# EAGLE design Schematics (EAGLE 6.0)
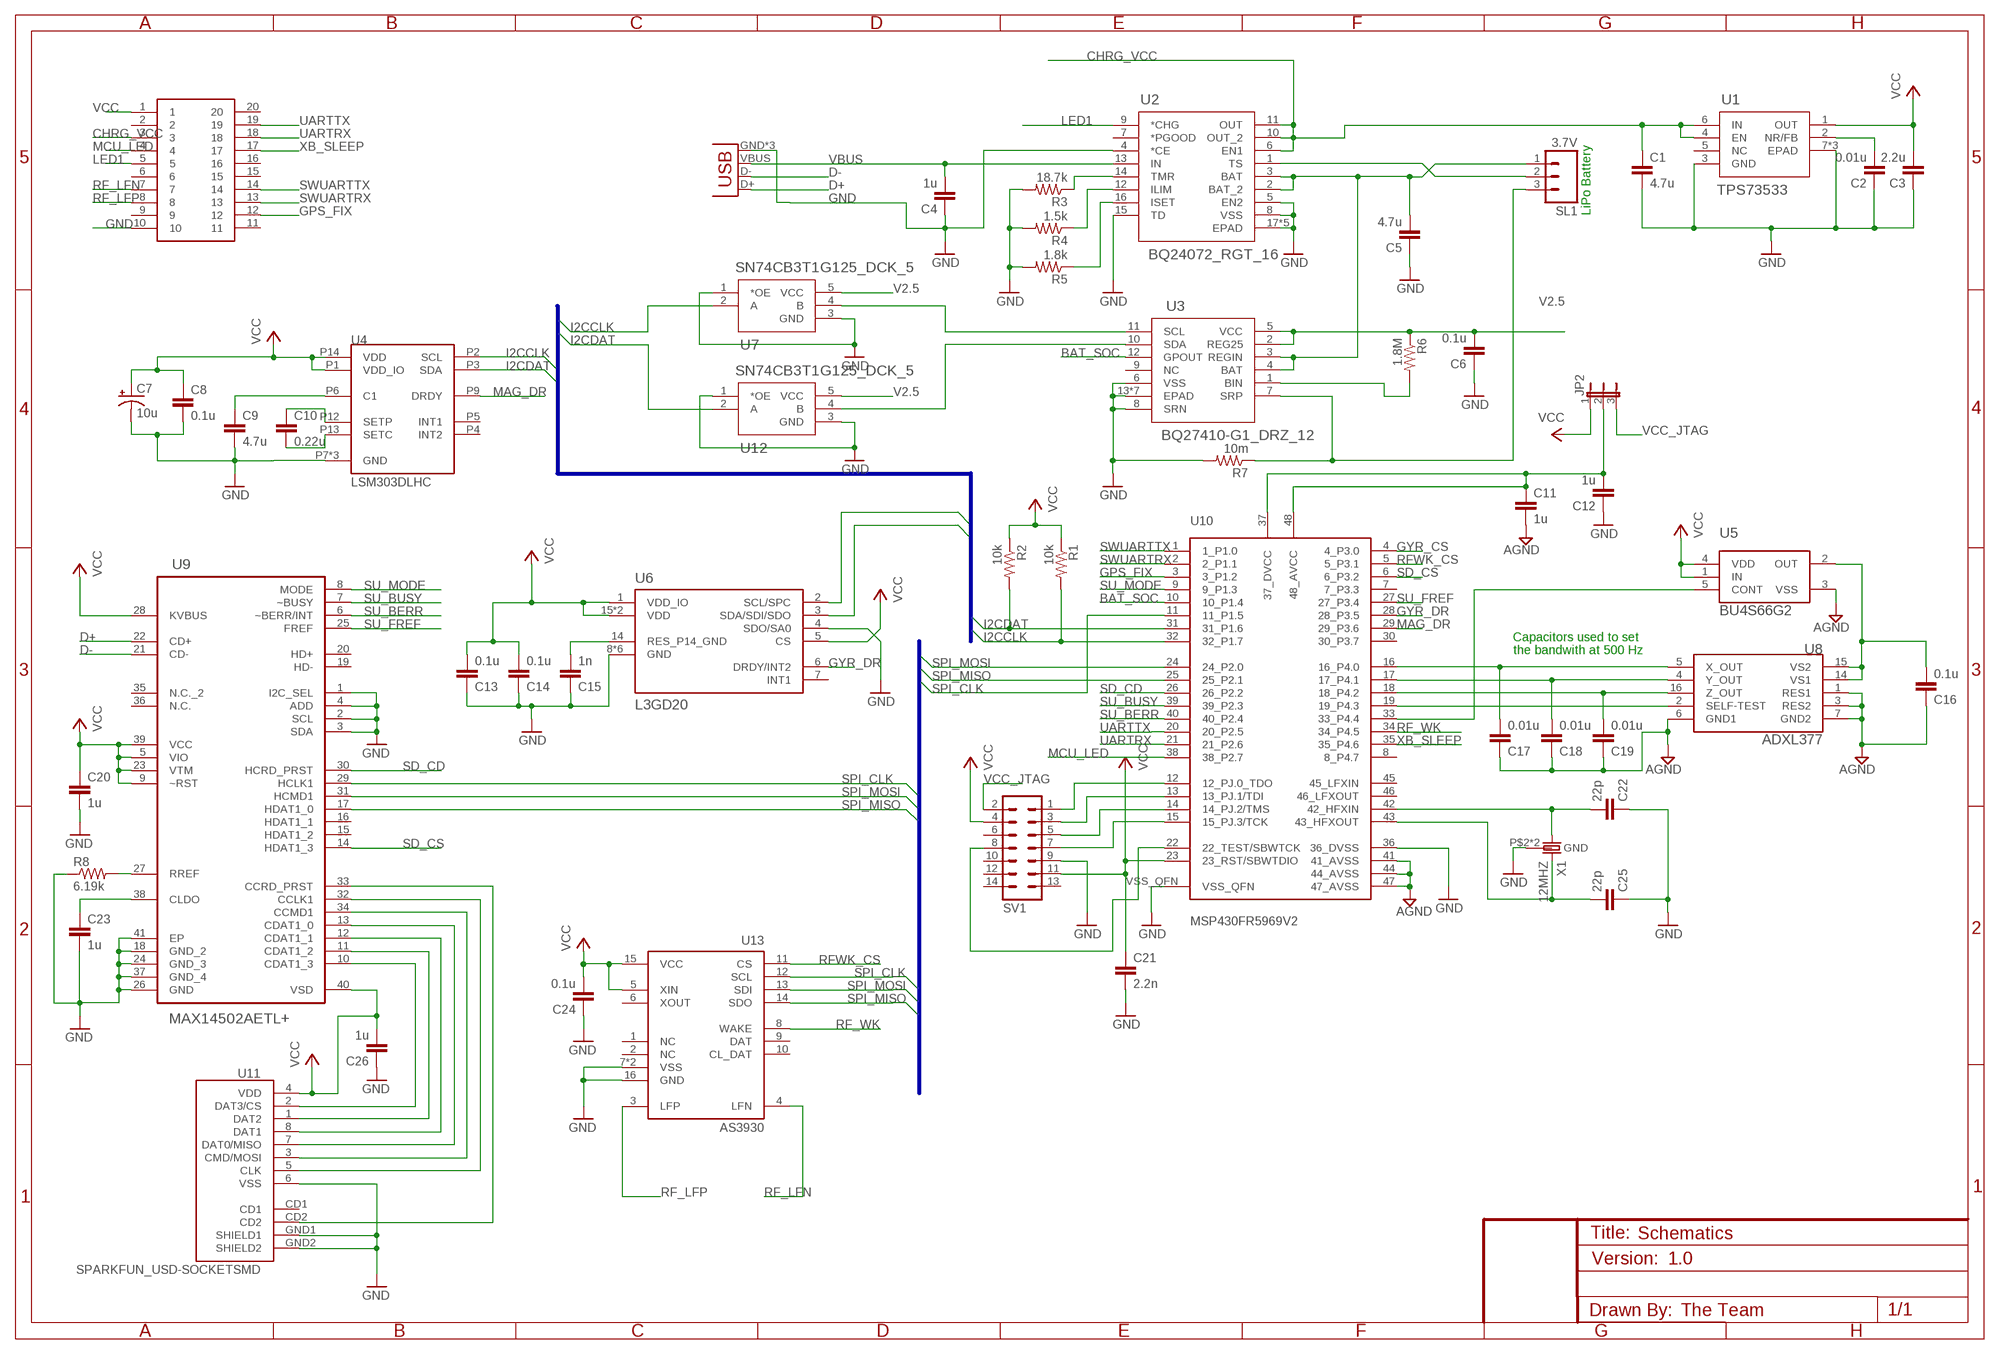
[diagram p0: schematic, sheet 1]

## Parts
C1  4.7u  C-EUC0603  [C0603]
C2  0.01u  C-EUC0603  [C0603]
C3  2.2u  C-EUC0603  [C0603]
C4  1u  C-EUC0603  [C0603]
C5  4.7u  C-EUC0603  [C0603]
C6  0.1u  C-EUC0603  [C0603]
C7  10u  SMD-AL-CAP  [ELECTROLYTIC_CAP]
C8  0.1u  C-EUC0603  [C0603]
C9  4.7u  C-EUC0603  [C0603]
C10  0.22u  C-EUC0603  [C0603]
C11  1u  C-EUC0603  [C0603]
C12  1u  C-EUC0603  [C0603]
C13  0.1u  C-EUC0603  [C0603]
C14  0.1u  C-EUC0603  [C0603]
C15  1n  C-EUC0603  [C0603]
C16  0.1u  C-EUC0603  [C0603]
C17  0.01u  C-EUC0603  [C0603]
C18  0.01u  C-EUC0603  [C0603]
C19  0.01u  C-EUC0603  [C0603]
C20  1u  C-EUC0603  [C0603]
C21  2.2n  C-EUC0603  [C0603]
C22  22p  C-EUC0603  [C0603]
C23  1u  C-EUC0603  [C0603]
C24  0.1u  C-EUC0603  [C0603]
C25  22p  C-EUC0603  [C0603]
C26  1u  C-EUC0603  [C0603]
JP1  USB-MICROB  [USB-MICROB]
JP2  JP2E  [JP2]
JP3  20-SOCKET  [20-SOCKET]
R1  10k  R-US_R0603  [R0603]
R2  10k  R-US_R0603  [R0603]
R3  18.7k  R-US_R0603  [R0603]
R4  1.5k  R-US_R0603  [R0603]
R5  1.8k  R-US_R0603  [R0603]
R6  1.8M  R-US_R0603  [R0603]
R7  10m  R-US_R0603  [R0603]
R8  6.19k  R-US_R0603  [R0603]
SL1  3.7V  M03  [03P]
SV1  ML14  [ML14]
U1  TPS73533  TPS73533_DRV_6  [DRV6_1P6X1]
U2  BQ24072_RGT_16  [RGT16_1P7X1P7]
U3  BQ27410-G1_DRZ_12  [DRZ12_1P95X2P45]
U4  LSM303DLHC  [LGA_3X5X1_14L]
U5  BU4S66G2  [SSOP5]
U6  L3GD20  [L3GD20]
U7  SN74CB3T1G125_DCK_5  [DCK5]
U8  ADXL377  [LFCSP-16]
U9  MAX14502AETL+  [QFN40P500X500X80-41N]
U10  MSP430FR5969V2  [RGZ(S-PVQFN-N48)]
U11  SPARKFUN_USD-SOCKETSMD  [SPARKFUN_MICRO-SD-SOCKET-PP]
U12  SN74CB3T1G125_DCK_5  [DCK5]
U13  AS3930  [AS3930]
X1  12MHZ  [12MHZ]

## Nets
AGND: C11.2 C16.1 C17.1 C18.1 C19.1 U5.3(VSS) U8.1(RES1) U8.3(RES2) U8.6(GND1) U8.7(GND2) U10.41(41_AVSS) U10.44(44_AVSS) U10.47(47_AVSS)
BAT_SOC: U3.12(GPOUT) U10.10(10_P1.4)
CHRG_VCC: C1.1 JP3.3 U1.4(EN) U1.6(IN) U2.6(EN1) U2.10(OUT_2) U2.11(OUT)
D+: JP1.D+ U9.22(CD+)
D-: JP1.D- U9.21(CD-)
GND: C1.2 C2.1 C3.1 C4.1 C5.1 C6.1 C7.- C8.2 C9.2 C12.1 C13.1 C14.1 C15.1 C20.2 C21.2 C22.1 C23.2 C24.1 C25.1 C26.1 JP1.GND JP1.MT1(GND) JP1.MT2(GND) JP3.10 R3.2 R4.2 R5.2 R7.2 R8.1 SV1.9 U1.3(GND) U1.7(EPAD) U1.V(EPAD) U1.V_2(EPAD) U2.4(*CE) U2.5(EN2) U2.8(VSS) U2.15(TD) U2.17(EPAD) U2.V(EPAD) U2.V_2(EPAD) U2.V_3(EPAD) U2.V_4(EPAD) U3.6(VSS) U3.8(SRN) U3.13(EPAD) U3.V(EPAD) U3.V_2(EPAD) U3.V_3(EPAD) U3.V_4(EPAD) U3.V_5(EPAD) U3.V_6(EPAD) U4.P7(GND) U4.P10(GND) U4.P11(GND) U6.4(SDO/SA0) U6.8(GND) U6.9(GND) U6.10(GND) U6.11(GND) U6.12(GND) U6.13(GND) U7.1(*OE) U7.3(GND) U9.1(I2C_SEL) U9.2(SCL) U9.3(SDA) U9.4(ADD) U9.18(GND_2) U9.24(GND_3) U9.26(GND) U9.37(GND_4) U9.41(EP) U10.36(36_DVSS) U10.VSS_QFN U11.6(VSS) U11.GND1(SHIELD1) U11.GND2(SHIELD2) U12.1(*OE) U12.3(GND) U13.7(VSS) U13.16(GND) U13.EXP(VSS) X1.P$2(GND) X1.P$4(GND)
GPS_FIX: JP3.12 U10.3(3_P1.2)
GYR_CS: U10.4(4_P3.0)
GYR_DR: U6.6(DRDY/INT2) U10.28(28_P3.5)
I2CCLK: R1.2 U4.P2(SCL) U6.2(SCL/SPC) U7.2(A) U10.32(32_P1.7)
I2CDAT: R2.2 U4.P3(SDA) U6.3(SDA/SDI/SDO) U10.31(31_P1.6) U12.2(A)
LED1: JP3.5 U2.9(*CHG)
MAG_DR: U4.P9(DRDY) U10.29(29_P3.6)
MCU_LED: JP3.4 U10.38(38_P2.7)
N$1: U5.5(CONT) U10.33(33_P4.4)
N$2: C16.2 U5.2(OUT) U8.14(VS1) U8.15(VS2)
N$3: SL1.2 U2.1(TS)
N$4: U3.11(SCL) U7.4(B)
N$5: U8.2(SELF-TEST) U10.19(19_P4.3)
N$6: U3.10(SDA) U12.4(B)
N$8: C15.2 U6.14(RES_P14_GND)
N$9: SV1.1 U10.12(12_PJ.0_TDO)
N$10: C11.1 C12.2 JP2.2 U10.37(37_DVCC) U10.48(48_AVCC)
N$11: SV1.3 U10.13(13_PJ.1/TDI)
N$12: C22.2 U10.42(42_HFXIN) X1.P$1
N$15: C25.2 U10.43(43_HFXOUT) X1.P$3
N$16: U9.10(CDAT1_3) U11.2(DAT3/CS)
N$17: U9.11(CDAT1_2) U11.1(DAT2)
N$18: C17.2 U8.5(X_OUT) U10.16(16_P4.0)
N$19: U9.12(CDAT1_1) U11.8(DAT1)
N$20: C18.2 U8.4(Y_OUT) U10.17(17_P4.1)
N$21: C19.2 U8.16(Z_OUT) U10.18(18_P4.2)
N$22: R6.2 U3.1(BIN)
N$23: U9.13(CDAT1_0) U11.7(DAT0/MISO)
N$25: C9.1 U4.P6(C1)
N$26: C10.1 U4.P12(SETP)
N$27: C10.2 U4.P13(SETC)
N$28: R5.1 U2.16(ISET)
N$29: R4.1 U2.12(ILIM)
N$30: R3.1 U2.14(TMR)
N$31: C2.2 U1.2(NR/FB)
N$32: U9.34(CCMD1) U11.3(CMD/MOSI)
N$33: R7.1 SL1.3 U3.7(SRP)
N$34: SV1.5 U10.14(14_PJ.2/TMS)
N$37: U9.32(CCLK1) U11.5(CLK)
N$38: SV1.7 U10.15(15_PJ.3/TCK)
N$39: C5.2 SL1.1 U2.2(BAT_2) U2.3(BAT) U3.3(REGIN) U3.4(BAT)
N$43: U9.33(CCRD_PRST) U11.CD2
N$44: SV1.8 U10.22(22_TEST/SBWTCK)
N$46: R8.2 U9.27(RREF)
N$48: C23.1 U9.38(CLDO)
RF_LFN: JP3.7 U13.4(LFN)
RF_LFP: JP3.8 U13.3(LFP)
RF_WK: U10.34(34_P4.5) U13.8(WAKE)
RFWK_CS: U10.5(5_P3.1) U13.11(CS)
SD_CD: U9.30(HCRD_PRST) U10.26(26_P2.2)
SD_CS: U9.14(HDAT1_3) U10.6(6_P3.2)
SPI_CLK: U9.29(HCLK1) U10.11(11_P1.5) U13.12(SCL)
SPI_MISO: U9.17(HDAT1_0) U10.25(25_P2.1) U13.14(SDO)
SPI_MOSI: U9.31(HCMD1) U10.24(24_P2.0) U13.13(SDI)
SU_BERR: U9.6(~BERR/INT) U10.40(40_P2.4)
SU_BUSY: U9.7(~BUSY) U10.39(39_P2.3)
SU_FREF: U9.25(FREF) U10.27(27_P3.4)
SU_MODE: U9.8(MODE) U10.9(9_P1.3)
SWUARTRX: JP3.13 U10.2(2_P1.1)
SWUARTTX: JP3.14 U10.1(1_P1.0)
UARTRX: JP3.18 U10.21(21_P2.6)
UARTTX: JP3.19 U10.20(20_P2.5)
V2.5: C6.2 R6.1 U3.2(REG25) U3.5(VCC) U7.5(VCC) U12.5(VCC)
VBUS: C4.2 JP1.VBUS U2.13(IN)
VCC: C3.2 C7.+ C8.1 C13.2 C14.2 C20.1 C21.1 C24.2 C26.2 JP2.1 JP3.1 R1.1 R2.1 SV1.4 SV1.11 U1.1(OUT) U4.P1(VDD_IO) U4.P14(VDD) U5.1(IN) U5.4(VDD) U6.1(VDD_IO) U6.5(CS) U6.15(VDD) U6.16(VDD) U9.5(VIO) U9.9(~RST) U9.23(VTM) U9.28(KVBUS) U9.39(VCC) U9.40(VSD) U10.23(23_RST/SBWTDIO) U11.4(VDD) U13.5(XIN) U13.15(VCC)
VCC_JTAG: JP2.3 SV1.2
XB_SLEEP: JP3.17 U10.35(35_P4.6)
Unconnected: JP3.2 JP3.6 JP3.9 JP3.11 JP3.15 JP3.16 JP3.20 SV1.6 SV1.10 SV1.12 SV1.13 SV1.14 U1.5(NC) U2.7(*PGOOD) U3.9(NC) U4.P4(INT2) U4.P5(INT1) U6.7(INT1) U9.15(HDAT1_2) U9.16(HDAT1_1) U9.19(HD-) U9.20(HD+) U9.35(N.C._2) U9.36(N.C.) U10.7(7_P3.3) U10.8(8_P4.7) U10.30(30_P3.7) U10.45(45_LFXIN) U10.46(46_LFXOUT) U11.CD1 U13.1(NC) U13.2(NC) U13.6(XOUT) U13.9(DAT) U13.10(CL_DAT)

## Buses
I2CDAT,I2CCLK
SPI_CLK,SPI_MOSI,SPI_MISO

## Notes on the sheet
- LiPo Battery
- Capacitors used to set
- the bandwith at 500 Hz

## Library data of the parts
C1-C6 C8-C26 = rcl:C-EU: CAPACITOR, European symbol
C7 = Micro2:SMD-AL-CAP
JP1 = SparkFun-Connectors:USB: USB Connectors USB-B-PTH is fully proven SKU : PRT-00139/CONN-08278 USB-miniB is fully proven SKU : PRT-00587 USB-A-PCB is untested. USB-A-H is throughly reviewed, but untested. Spark Fun Electronics SKU : PRT-00437 USB-B-SMT is throughly reviewed, but untested. Needs silkscreen touching up. USB-A-S has not been used/tested USB-MB-H has not been used/tested USB-MICROB has been used. CONN-09505; PROD_ID: CONN-09505
JP2 = jumper:JP2E: JUMPER
JP3 = Micro2:20-SOCKET
R1-R8 = rcl:R-US_: RESISTOR, American symbol
SL1 = con-amp-quick:M03: AMP QUICK CONNECTOR; OC_FARNELL: unknown; OC_NEWARK: unknown
SV1 = con-ml:ML14: HARTING; OC_FARNELL: unknown; OC_NEWARK: unknown
U1 = Micro2:TPS73533_DRV_6; DATASHEETURL: http://www.ti.com/lit/gpn/TPS73533; DESCRIPTION: Single Output LDO, 500mA, Fixed (3.3V), Low Quiescent Current, Low Noise, High PSRR; FAMILY_NAME: SINGLE CHANNEL LDO; GENERIC_PART_NUMBER: TPS73533; INDUSTRY_STD_PKG_TYPE: SON; MANUFACTURER: Texas Instruments; MANUFACTURER_PART_NUMBER: tps73533_drv_6; PACKAGE_DESIGNATOR: DRV; PIN_COUNT: 6; VENDOR: Texas Instruments
U2 = Micro2:BQ24072_RGT_16; DATASHEETURL: http://www.ti.com/lit/gpn/BQ24072; DESCRIPTION: USB-Friendly Li-Ion Battery Charger and Power-Path Management IC, Vout 200mV above Vbat; FAMILY_NAME: BATTERY CHARGE MANAGEMENT; GENERIC_PART_NUMBER: BQ24072; INDUSTRY_STD_PKG_TYPE: QFN; MANUFACTURER: Texas Instruments; PACKAGE_DESIGNATOR: RGT; PIN_COUNT: 16
U3 = Micro2:BQ27410-G1_DRZ_12; DATASHEETURL: http://www.ti.com/lit/gpn/BQ27410-G1; DESCRIPTION: System-Side Impedance Track Fuel Gauge With Direct Battery Connection; FAMILY_NAME: BATTERY FUEL GAUGE; GENERIC_PART_NUMBER: BQ27410-G1; INDUSTRY_STD_PKG_TYPE: SON; MANUFACTURER: Texas Instruments; PACKAGE_DESIGNATOR: DRZ; PIN_COUNT: 12
U4 = Micro2:LSM303DLHC
U5 = Micro2:BU4S66G2
U6 = Micro2:L3GD20: L3GD20
U7 U12 = Micro2:SN74CB3T1G125_DCK_5; DATASHEETURL: http://www.ti.com/lit/gpn/SN74CB3T1G125; DESCRIPTION: Single FET 2.5-V/3.3-V Low-Voltage Bus Switch with 5-V Tolerant Level Shifter; FAMILY_NAME: TRANSLATING BUS SWITCH; GENERIC_PART_NUMBER: SN74CB3T1G125; INDUSTRY_STD_PKG_TYPE: SC70; MANUFACTURER: Texas Instruments; MANUFACTURER_PART_NUMBER: sn74cb3t1g125_dck_5; PACKAGE_DESIGNATOR: DCK; PIN_COUNT: 5; VENDOR: Texas Instruments
U8 = Micro2:ADXL377
U9 = Micro2:MAX14502AETL+: Hi-Speed USB-to-SD Card Readers with Bypass; MPN: MAX14502AETL+; OC_FARNELL: -; OC_NEWARK: 09R0393; PACKAGE: TQFN-40; SUPPLIER: Maxim
U10 = Micro2:MSP430FR5969
U11 = Micro2:SPARKFUN_USD-SOCKET: microSD Socket Push-push type uSD socket. Schematic element and footprint production proven. Spark Fun Electronics SKU : PRT-00127. tDoc lines correctly indicate media card edge positions when inserting (unlocked, locked, depressed).
U13 = Micro2:AS3930: AS3930
X1 = 12Mhz:12MHZ

## Board
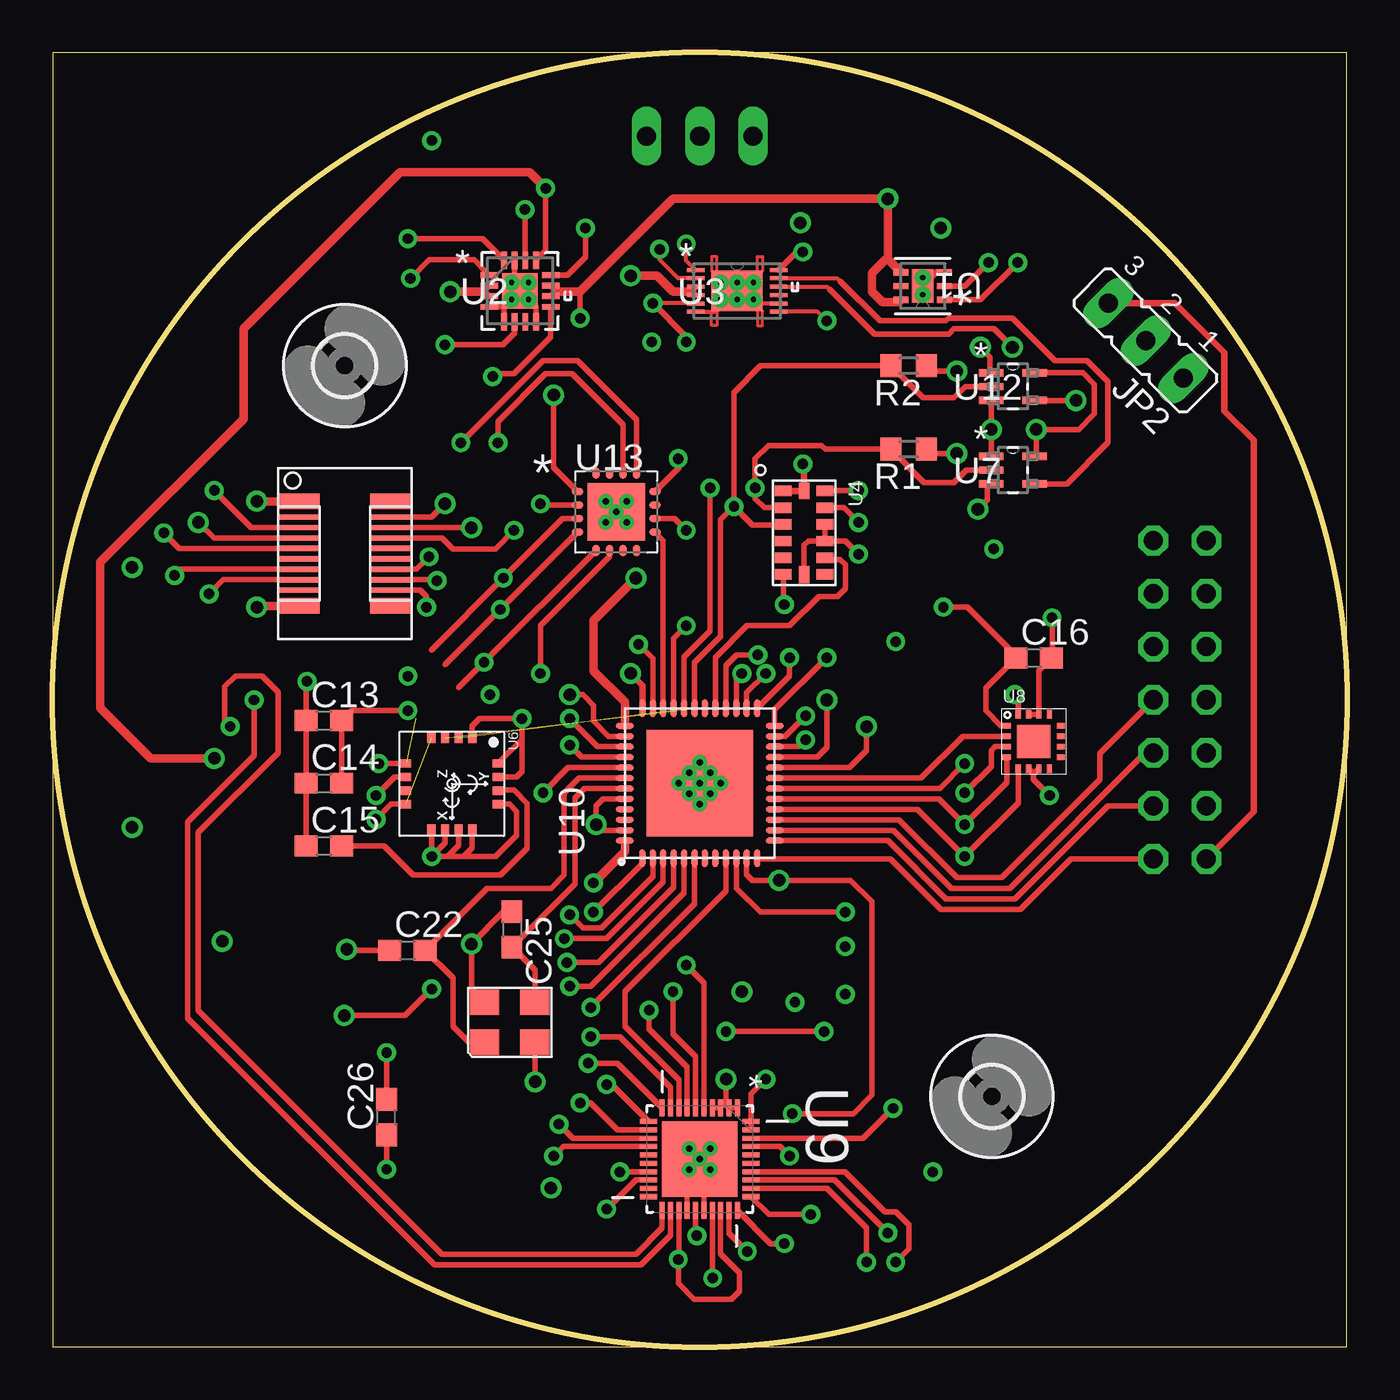
[diagram p1: board, top side]
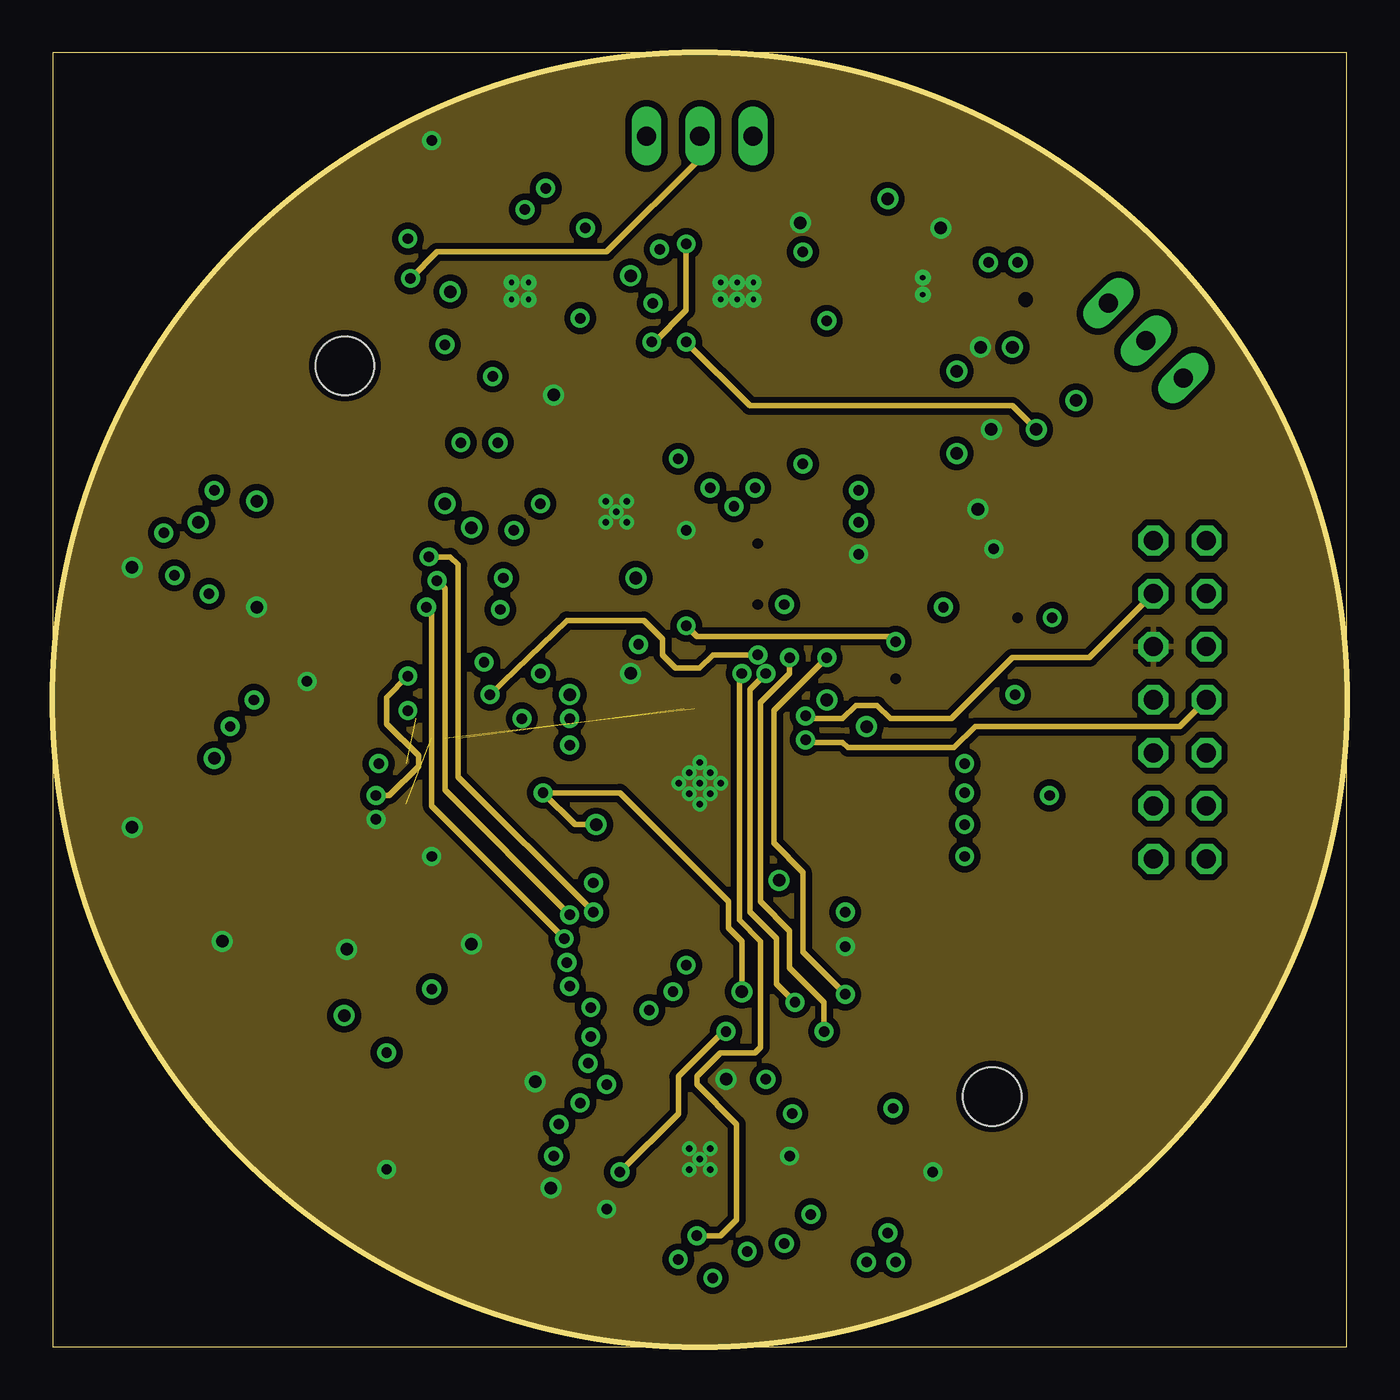
[diagram p2: board, inner layer GND]
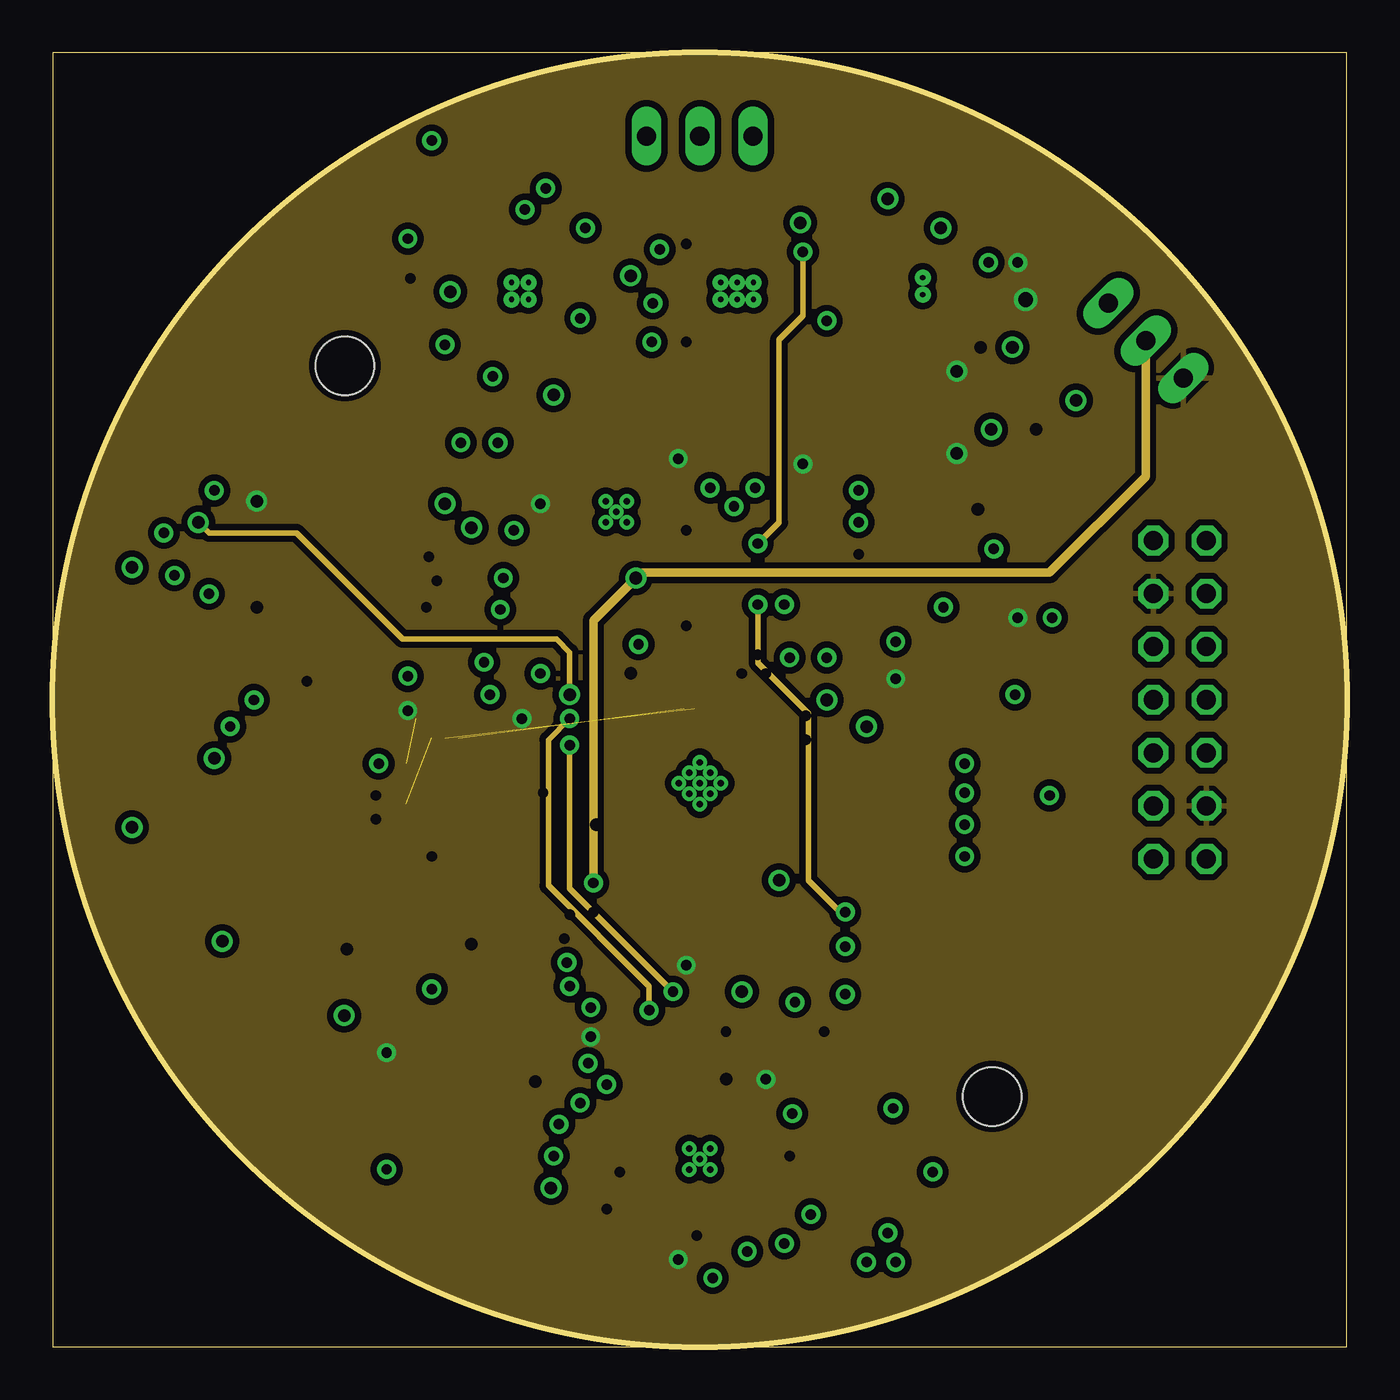
[diagram p3: board, inner layer VCC]
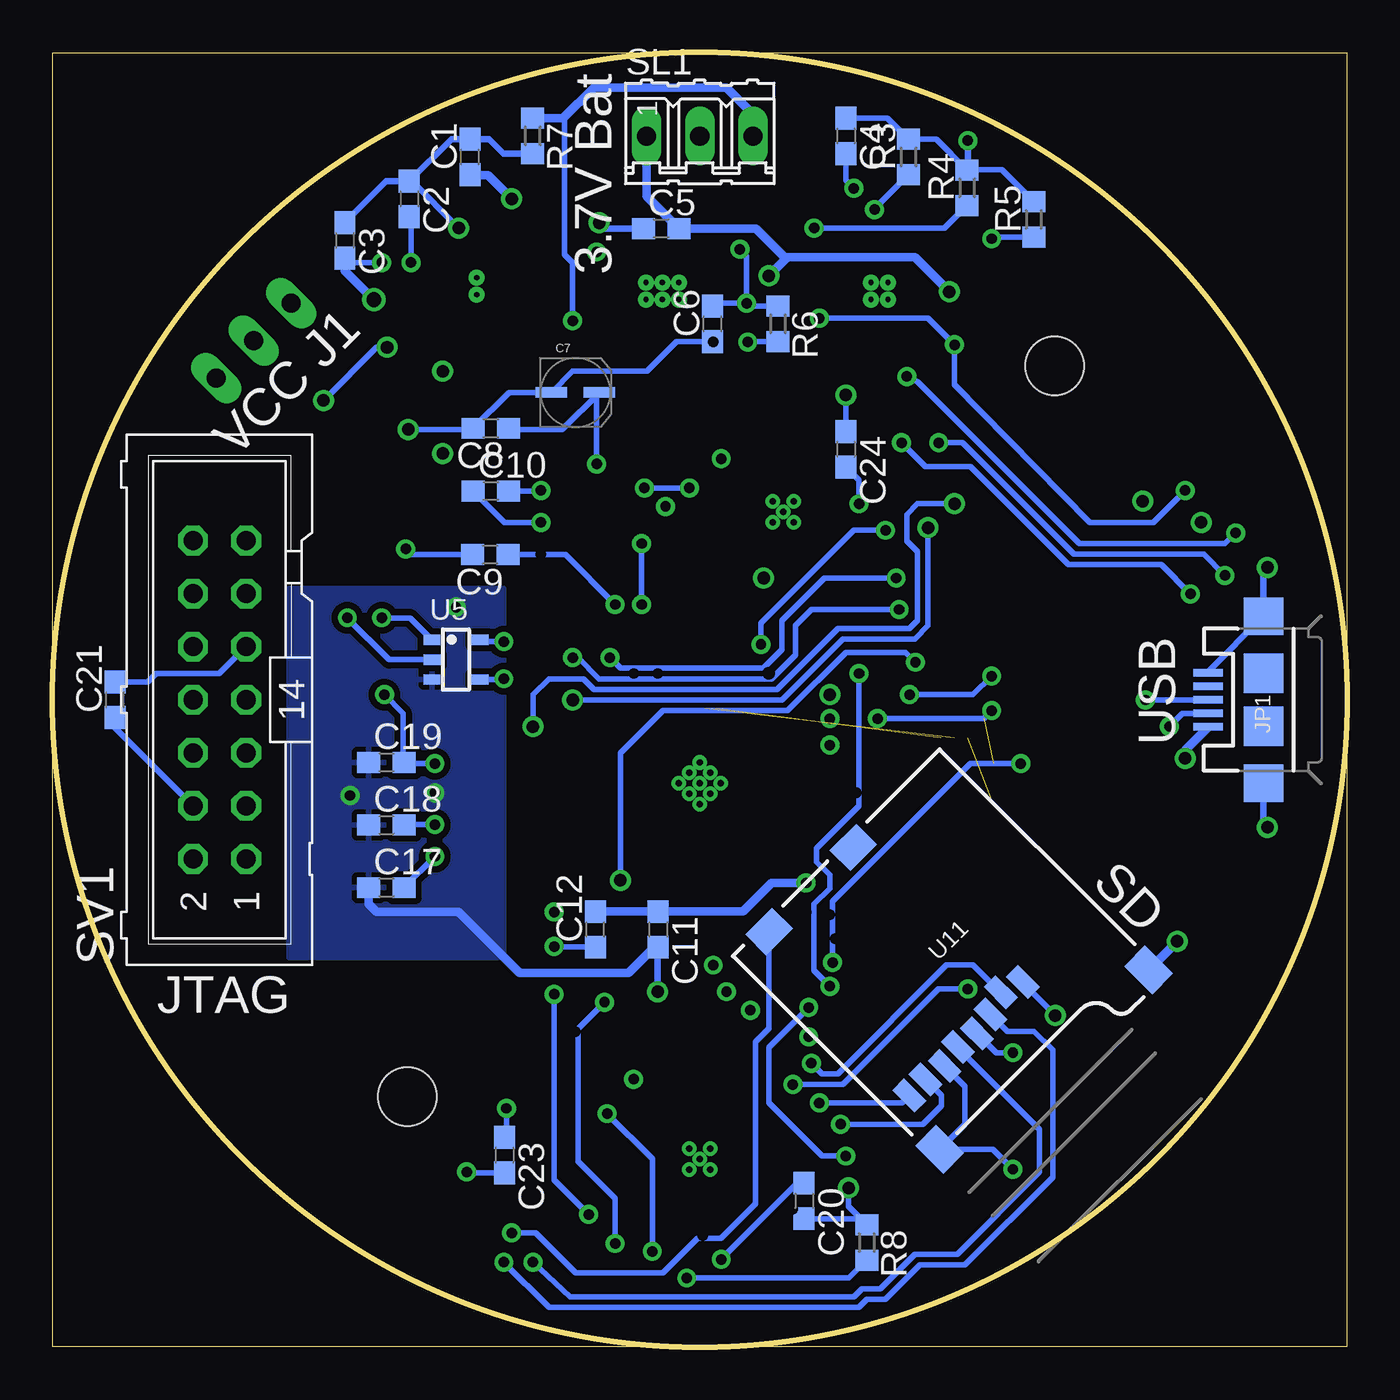
[diagram p4: board, bottom side, seen from below]

Size 62.03 x 62.03 mm. Coordinates in mm from the lower left corner, seen from the top.
Outline: 0.02,0.02 62.02,0.02 62.02,62.02 0.02,62.02 0.02,0.02
Outline: circle at 31.02,31.02 radius 31.02
Copper layers ((1*2)+(15*16)): Top 0.0178mm / dielectric 12mil / GND 0.0356mm / dielectric 28mil / VCC 0.0356mm / dielectric 12mil / Bottom 0.0175mm
Design rules: minimum track width 6mil, minimum drill 15mil, track to track 6mil, track to pad 6mil, pad to pad 6mil, via to via 6mil, smd to smd 6mil, copper to edge 0mil, drill to drill 6mil, minimum pad ring 10mil, minimum via ring 8mil, stop-mask expansion 4mil, vias tented up to drill 0mil, thermal gap 10mil

### Footprints (pad centres in the part's own frame; a part is rotated, then mirrored left to right if it is on the bottom)
C0603 = smd 1.1 x 1: 1 -0.85,0; 2 0.85,0
ELECTROLYTIC_CAP = smd 1.5 x 0.5: + 1.15,0; - -1.15,0
USB-MICROB = smd 0.35 x 1.4: D+ 0,2.65; D- -0.65,2.65; GND 1.3,2.65; ID 0.65,2.65; VBUS -1.3,2.65 | smd 1.8 x 1.9: MT1 -4,0; MT2 4,0 | smd 1.9 x 1.9: P$1 -1.27,0; P$2 1.27,0
JP2 = drill 0.914 long: 1 -2.54,0; 2 0,0; 3 2.54,0
20-SOCKET = smd 0.75 x 2: 1 2.5,2.2; 10 -2.5,2.2; 11 -2.5,-2.2; 20 2.5,-2.2 | smd 0.25 x 2: 2 1.75,2.2; 3 1.25,2.2; 4 0.75,2.2; 5 0.25,2.2; 6 -0.25,2.2; 7 -0.75,2.2; 8 -1.25,2.2; 9 -1.75,2.2; 12 -1.75,-2.2; 13 -1.25,-2.2; 14 -0.75,-2.2; 15 -0.25,-2.2; 16 0.25,-2.2; 17 0.75,-2.2; 18 1.25,-2.2; 19 1.75,-2.2
R0603 = smd 1 x 1.1: 1 -0.85,0; 2 0.85,0
03P = drill 0.914 long: 1 -2.54,0; 2 0,0; 3 2.54,0
ML14 = drill 0.914 octagon: 1 -7.62,-1.27; 2 -7.62,1.27; 3 -5.08,-1.27; 4 -5.08,1.27; 5 -2.54,-1.27; 6 -2.54,1.27; 7 0,-1.27; 8 0,1.27; 9 2.54,-1.27; 10 2.54,1.27; 11 5.08,-1.27; 12 5.08,1.27; 13 7.62,-1.27; 14 7.62,1.27
DRV6_1P6X1 = smd 0.711 x 0.305: 1 -1.041,0.66; 2 -1.041,0; 3 -1.041,-0.66; 4 1.041,-0.66; 5 1.041,0; 6 1.041,0.66 | smd 1.016 x 1.6: 7 0,0 | drill 0.254: V 0,-0.406; V_2 0,0.406
RGT16_1P7X1P7 = smd 0.838 x 0.279: 1 -1.473,0.762; 2 -1.473,0.254; 3 -1.473,-0.254; 4 -1.473,-0.762; 9 1.473,-0.762; 10 1.473,-0.254; 11 1.473,0.254; 12 1.473,0.762 | smd 0.279 x 0.838: 5 -0.762,-1.473; 6 -0.254,-1.473; 7 0.254,-1.473; 8 0.762,-1.473; 13 0.762,1.473; 14 0.254,1.473; 15 -0.254,1.473; 16 -0.762,1.473 | smd 1.702 x 1.702: 17 0,0 | drill 0.254: V 0.406,0.406; V_2 -0.406,0.406; V_3 -0.406,-0.406; V_4 0.406,-0.406
DRZ12_1P95X2P45 = smd 0.838 x 0.203: 1 -1.981,0.991; 2 -1.981,0.61; 3 -1.981,0.203; 4 -1.981,-0.203; 5 -1.981,-0.61; 6 -1.981,-0.991; 7 1.981,-0.991; 8 1.981,-0.61; 9 1.981,-0.203; 10 1.981,0.203; 11 1.981,0.61; 12 1.981,0.991 | smd 2.438 x 1.956: 13 0,0 | drill 0.254: V 0.787,0.406; V_2 -0.787,0.406; V_3 -0.787,-0.406; V_4 0,-0.406; V_5 0,0.406; V_6 0.787,-0.406
LGA_3X5X1_14L = smd 0.5 x 0.8: P1 -2,-1; P2 -1.2,-1; P3 -0.4,-1; P4 0.4,-1; P5 1.2,-1; P6 2,-1; P8 2,1; P9 1.2,1; P10 0.4,1; P11 -0.4,1; P12 -1.2,1; P13 -2,1 | smd 0.8 x 0.5: P7 2,0; P14 -2,0
SSOP5 = smd 0.8 x 0.5: 1 -1.15,0.95; 2 -1.143,0; 3 -1.15,-0.95; 4 1.15,-0.95; 5 1.15,0.95
L3GD20 = smd 0.5 x 0.4: 1 -2.2,0.975; 2 -2.2,0.325; 3 -2.2,-0.325; 4 -2.2,-0.975; 9 2.2,-0.975; 10 2.2,-0.325; 11 2.2,0.325; 12 2.2,0.975 | smd 0.4 x 0.5: 5 -0.975,-2.2; 6 -0.325,-2.2; 7 0.325,-2.2; 8 0.975,-2.2; 13 0.975,2.2; 14 0.325,2.2; 15 -0.325,2.2; 16 -0.975,2.2
DCK5 = smd 1.168 x 0.356: 1 -1.041,0.66; 2 -1.041,0; 3 -1.041,-0.66; 4 1.041,-0.66; 5 1.041,0.66
LFCSP-16 = smd 0.4 x 0.25: 1 -1.3,0.75; 2 -1.3,0.25; 3 -1.3,-0.25; 4 -1.3,-0.75; 9 1.3,-0.75; 10 1.3,-0.25; 11 1.3,0.25; 12 1.3,0.75 | smd 0.25 x 0.4: 5 -0.75,-1.3; 6 -0.25,-1.3; 7 0.25,-1.3; 8 0.75,-1.3; 13 0.75,1.3; 14 0.25,1.3; 15 -0.25,1.3; 16 -0.75,1.3 | smd 1.6 x 1.6: NC 0,0
QFN40P500X500X80-41N = smd 0.813 x 0.254: 1 -2.464,1.803; 2 -2.464,1.397; 3 -2.464,0.991; 4 -2.464,0.61; 5 -2.464,0.203; 6 -2.464,-0.203; 7 -2.464,-0.61; 8 -2.464,-0.991; 9 -2.464,-1.397; 10 -2.464,-1.803; 21 2.464,-1.803; 22 2.464,-1.397; 23 2.464,-0.991; 24 2.464,-0.61; 25 2.464,-0.203; 26 2.464,0.203; 27 2.464,0.61; 28 2.464,0.991; 29 2.464,1.397; 30 2.464,1.803 | smd 0.254 x 0.813: 11 -1.803,-2.464; 12 -1.397,-2.464; 13 -0.991,-2.464; 14 -0.61,-2.464; 15 -0.203,-2.464; 16 0.203,-2.464; 17 0.61,-2.464; 18 0.991,-2.464; 19 1.397,-2.464; 20 1.803,-2.464; 31 1.803,2.464; 32 1.397,2.464; 33 0.991,2.464; 34 0.61,2.464; 35 0.203,2.464; 36 -0.203,2.464; 37 -0.61,2.464; 38 -0.991,2.464; 39 -1.397,2.464; 40 -1.803,2.464 | smd 3.607 x 3.607: 41 0,0
RGZ(S-PVQFN-N48) = smd 0.85 x 0.28: 1 -3.587,2.75; 2 -3.587,2.25; 3 -3.587,1.75; 4 -3.587,1.25; 5 -3.587,0.75; 6 -3.587,0.25; 7 -3.587,-0.25; 8 -3.587,-0.75; 9 -3.587,-1.25; 10 -3.587,-1.75; 11 -3.587,-2.25; 12 -3.587,-2.75; 25 3.587,-2.75; 26 3.587,-2.25; 27 3.587,-1.75; 28 3.587,-1.25; 29 3.587,-0.75; 30 3.587,-0.25; 31 3.587,0.25; 32 3.587,0.75; 33 3.587,1.25; 34 3.587,1.75; 35 3.587,2.25; 36 3.587,2.75 | smd 0.28 x 0.85: 13 -2.75,-3.587; 14 -2.25,-3.587; 15 -1.75,-3.587; 16 -1.25,-3.587; 17 -0.75,-3.587; 18 -0.25,-3.587; 19 0.25,-3.587; 20 0.75,-3.587; 21 1.25,-3.587; 22 1.75,-3.587; 23 2.25,-3.587; 24 2.75,-3.587; 37 2.75,3.587; 38 2.25,3.587; 39 1.75,3.587; 40 1.25,3.587; 41 0.75,3.587; 42 0.25,3.587; 43 -0.25,3.587; 44 -0.75,3.587; 45 -1.25,3.587; 46 -1.75,3.587; 47 -2.25,3.587; 48 -2.75,3.587 | smd 5.1 x 5.1: VSS_QFN 0,0
SPARKFUN_MICRO-SD-SOCKET-PP = smd 0.8 x 1.5: 1 -8.94,10.7; 2 -7.84,10.3; 3 -6.74,10.7; 4 -5.64,10.9; 5 -4.54,10.7; 6 -3.44,10.9; 7 -2.34,10.7; 8 -1.24,10.7 | smd 1.8 x 1.4: CD1 -7.75,0.4; CD2 -2.05,0.4 | smd 1.4 x 1.9: GND1 -13.6,14.55; GND2 -0.45,13.55
AS3930 = smd 0.35 x 0.55: 1 -0.975,1.85; 2 -0.325,1.85; 3 0.325,1.85; 4 0.975,1.85; 9 0.975,-1.85; 10 0.325,-1.85; 11 -0.325,-1.85; 12 -0.975,-1.85 | smd 0.55 x 0.35: 5 1.85,0.975; 6 1.85,0.325; 7 1.85,-0.325; 8 1.85,-0.975; 13 -1.85,-0.975; 14 -1.85,-0.325; 15 -1.85,0.325; 16 -1.85,0.975 | smd 2.76 x 2.76: EXP 0,0
2,8 = hole 2.8: 0,0
12MHZ = smd 1.4 x 1.2: P$1 0.7,0.6; P$2 3.1,0.6; P$3 3.1,2.5; P$4 0.7,2.5

### Placement (x,y rotation side)
C1  42.02,57.02 90 bottom
C2  44.93,55 270 bottom
C3  48.02,53.02 270 bottom
C4  24.02,58.02 270 bottom
C5  32.87,53.59 0 bottom
C6  30.4,49.02 90 bottom
C7  36.97,45.74 0 bottom
C8  41.02,44.02 180 bottom
C9  41.06,37.96 180 bottom
C10  41.02,41.02 0 bottom
C11  33.02,20.02 270 bottom
C12  36.02,20.02 90 bottom
C13  13.02,30.02 0 top
C14  13.02,27.02 0 top
C15  13.02,24.02 0 top
C16  47.02,33.02 0 top
C17  46.02,22.02 0 bottom
C18  46.02,25.02 0 bottom
C19  46.02,28.02 0 bottom
C20  26.02,7.02 270 bottom
C21  59.02,31.02 90 bottom
C22  17.02,19.02 0 top
C23  40.37,9.2 270 bottom
C24  24.02,43.02 270 bottom
C25  22.02,20.02 270 top
C26  16.02,11.02 90 top
JP1  4.02,31.02 90 bottom
JP2  52.38,48.22 135 top
JP3  14.02,38.02 90 top
R1  41.02,43.02 180 top
R2  41.02,47.02 180 top
R3  21.02,57.02 90 bottom
R4  18.21,55.54 90 bottom
R5  15.02,54.02 90 bottom
R6  27.27,49.02 270 bottom
R7  39.02,58.02 270 bottom
R8  23.02,5.02 270 bottom
SL1  31.02,58.02 0 bottom
SV1  54.02,31.02 90 bottom
U1  41.7,50.83 180 top
U2  22.41,50.6 0 top
U3  32.81,50.6 0 top
U4  36.02,39.02 270 top
U5  42.69,32.94 0 bottom
U6  19.14,26.99 270 top
U7  46.02,42.02 0 top
U8  47.02,29.02 0 top
U9  31.02,9.02 270 top
U10  31.02,27.02 90 top
U11  29.43,18.75 225 bottom
U12  46.02,46.02 0 top
U13  27.02,40.02 0 top
U$2  [2,8]  14.02,47.02 0 top
U$4  [2,8]  45.02,12.02 0 top
X1  20.02,14.02 0 top

### Tracks (layer width: path | path; a pad name or v marks a point on that pad's centre or on a via)
AGND  (via drill 0.5, 0.5 layers 1-2, 0.6, 0.6 layers 1-2)
  Top 0.254: U8.6 47.01,27.48 47.01,27.46 | U8.7 47.01,27.46 | 47.01,27.46 47.01,27.19 v47.77,26.43 | U8.3 45.15,28.77 44.97,28.59 44.97,27.83 v43.7,26.56 | U8.1 45.45,29.77 44.72,30.5 44.72,31.57 C16.1 46.14,33.02 46.12,33.04 46.24,33.04 43.83,35.45 v42.69,35.45 | U10.41 24.72,27.77 v23.51,26.56 | U10.44 26.39,26.27 26.05,25.92 v26.05,25.04 26.32,24.77 U10.47
  GND 0.254: v33.04,17.03 33.04,19.45 32.4,20.08 32.4,21.35 27.19,26.56 v23.51,26.56 25.04,25.04 v26.05,25.04
  Bottom 0.254: 33.04,19.07 33.02,19.09 C11.2
  Bottom 0.305: v33.04,17.03 33.04,19.07
  Bottom 0.406: C11.2 33.19,19.17 34.43,17.92 39.64,17.92 42.56,20.84 46.5,20.84 46.88,21.23 46.88,22 C17.1
  pour Bottom (isolate 0.305): 50.69,18.69 40.4,18.69 40.4,36.34 50.69,36.34
BAT_SOC  (via drill 0.5, 0.5 layers 15-16)
  Top 0.203: U3.12 34.81,51.59 34.81,51.58
  Top 0.254: U10.10 32.78,23.41 32.78,21.99 33.93,20.84 v37.99,20.84 | v35.96,52.47 35.67,52.47 U3.12
  VCC 0.254: v33.8,35.58 33.8,32.78 36.21,30.37 36.21,22.37 37.74,20.84 v37.99,20.84 | v33.8,38.5 34.81,39.51 34.81,48.28 35.96,49.42 v35.96,52.47
  Bottom 0.254: v33.8,35.58 v33.8,38.5
CHRG_VCC  (via drill 0.5, 0.6)
  Top 0.254: U2.6 22.15,48.57 21.61,48.02 v18.81,48.02 | v25.29,49.29 25.29,50.56 | v7.76,41.04 9.54,39.26 JP3.3
  Top 0.305: U2.10 24.1,50.56 | U2.11 24.17,50.56 24.4,50.56
  Top 0.406: 24.1,50.56 24.4,50.56 25.29,50.56 29.73,55.01 v40.02,55.01 40.02,52.12 | U1.4 40.02,52.12 | U1.6 40.54,50.05 39.77,50.05 39.26,50.56 39.26,51.45 39.93,52.12 40.02,52.12
  Bottom 0.254: v25.29,49.29 20.08,49.29 v18.81,48.02 18.81,46.12 12.34,39.51 9.29,39.51 v7.76,41.04 | 42.05,56.15 42.04,56.17 C1.1
  Bottom 0.406: v40.02,55.01 41.16,56.15 42.05,56.15
D+  (via drill 0.5)
  Top 0.254: U9.22 29.62,5.36 28.21,3.95 18.3,3.95 6.49,15.76 6.49,25.16 9.67,28.34 v9.67,31
  Bottom 0.254: v9.67,31 6.75,31 6.74,31.02 JP1.D+
D-  (via drill 0.5)
  Top 0.254: U9.21 29.21,5.72 27.96,4.46 18.69,4.46 7,16.15 7,24.65 10.81,28.46 10.81,31.39 10.05,32.15 8.78,32.15 8.27,31.64 8.27,29.99 v8.53,29.73
  Bottom 0.254: v8.53,29.73 7.89,30.37 JP1.D-
GND  (via drill 0.3, 0.5, 0.5 layers 1-2, 0.6, 0.6 layers 1-2)  (1 unrouted)
  Top 0.203: U3.8 33.42,49.99 U3.13 32.78,50.57 31.82,49.61 U3.6
  Top 0.254: U4.P11 U4.P10 | U4.P10 38,38.62 v38.62,37.99 | U13.16 24.02,42.14 v24.02,45.61 | U4.P7 36.02,38.43 36.21,38.62 U4.P10 | C15.1 C14.1 C13.1 12.17,31.85 v12.21,31.89 | U6.11 | U6.11 19.45,24.78 | U6.10 18.82,24.15 v18.18,23.51 | U6.8 16.24,26.02 v15.51,25.29 | C26.1 v16.02,8.53 | U9.4 U9.3 32.27,11.75 | U9.1 U9.2 32.27,11.62 32.27,11.75 | 32.27,11.75 v32.27,12.84 | U9.24 30.41,8.41 v30.52,8.52 U9.41 31.22,8.81 U9.26 | U2.15 22.15,50.85 U2.17 | U2.4 21.64,49.83 | U2.8 23.17,49.83 U2.17 | U2.5 21.64,49.83 | 21.64,49.83 22.37,50.56 | 22.37,50.56 U2.17 | U6.9 v18.17,23.52 v18.18,23.51 | U6.11 19.46,24.03 18.94,23.51 | 18.94,23.51 v18.18,23.51 | U6.12 20.12,23.93 19.7,23.51 | 19.7,23.51 18.94,23.51 | U6.13 21.9,26.02 22.24,25.67 22.24,24.53 21.23,23.51 19.7,23.51 | U2.V_2 22,50.93 22.37,50.56 | U3.V_6 33.15,50.19 32.78,50.57 | U1.V_2 41.68,50.42 41.67,50.44 41.67,50.8 U1.7 | U9.18 27.96,8.03 v26.56,6.62 | U9.37 34.86,9.63 v35.32,9.16 | U13.7 29.81,39.69 v30.37,39.13 | C25.1 21.63,20.87 v20.08,19.32 20.08,17.15 X1.P$4 | C22.1 14.16,19.02 v14.11,19.07 | X1.P$2 23.12,12.73 v23.13,12.72 | U7.3 44.79,41.36 44.79,40.59 v44.34,40.15 | U12.1 44.92,46.68 44.92,47.44 v44.47,47.9 | U7.1 v44.98,43.96 v44.97,43.96 U12.3
  Top 0.305: U10.36 28.27,31.71 v27.7,32.27 | U1.3 42.36,51.49 U1.7
  Top 0.406: JP3.10 9.86,35.52 v9.8,35.45
  GND 0.254: v38.62,37.99 38.62,37.86 | v12.21,31.89 12.34,32.02 | v15.51,25.29 15.51,25.16 | v23.89,7.64 23.89,7.76
  GND 0.305: v3.83,37.35 3.7,37.35 | v3.83,24.91 3.7,24.91
  GND 0.406: v9.8,35.45 9.67,35.32 | v8.14,19.45 8.02,19.45
  Bottom 0.254: C4.1 22.02,58.87 R3.2 19.69,57.87 R4.2 18.2,56.4 16.55,56.4 R5.2 | SV1.9 54.03,32.27 57.04,32.27 57.45,31.87 C21.2 | v24.02,45.61 C24.1 | v16.02,8.53 16.98,9.48 U11.GND2 19.51,9.48 18.3,10.68 18.3,12.49 U11.6 | C20.2 23.32,6.17 R8.1 23.89,6.74 v23.89,7.64 | C23.2 42.14,8.35 v42.18,8.4 | C12.1 37.99,19.17 v37.99,19.19 | 42.14,37.74 C9.2 44.82,37.96 v45.1,38.24 | C6.1 32.13,48.17 33.54,46.75 37.11,46.75 C7.- 40.15,45.74 C8.2 41.93,43.96 v44.98,43.96 | C2.1 44.9,55.85 44.85,55.9
  Bottom 0.305: C3.1 46.03,55.85 C2.1 42.91,57.87 C1.2 41.1,57.87 40.4,57.17 R7.2 | R4.2 18.18,56.42 v18.18,57.8 | v3.83,37.35 4.02,37.16 JP1.MT2 6.67,32.37 JP1.GND | JP1.MT1 4.02,25.1 v3.83,24.91 | C5.1 35.55,53.59 v35.83,53.86 | 44.85,55.9 v42.56,53.61
  Bottom 0.406: U11.GND1 v8.14,19.45
  other vias: 27.02,40.02 26.52,40.52 27.52,40.52 26.52,39.52 27.52,39.52 31.02,9.02 31.02,27.02 30.52,9.52 31.52,8.52 31.52,9.52 30.52,27.52 30.02,27.02 30.52,26.52 31.02,26.02 31.52,26.52 32.02,27.02 31.52,27.52 31.02,28.02
  pour GND (isolate 0.305): 0.02,31.02 arc90 31.02,0.02 arc90 62.02,31.02 arc90 31.02,62.02 arc90
  pour GND (no thermals): 21.27,51.64 23.51,51.64 23.51,49.4 21.27,49.4
  pour GND (no thermals): 31.26,51.83 34.31,51.83 34.31,49.29 31.26,49.29
  pour GND (no thermals): 40.66,49.67 42.69,49.67 42.69,52.09 40.66,52.09
GPS_FIX  (via drill 0.5 layers 1-2)
  Top 0.254: U10.3 29.27,22.28 26.56,19.57 v24.53,19.57 | JP3.12 17.61,36.27 17.92,35.96 v17.92,35.45
  GND 0.254: v24.53,19.57 18.18,25.92 18.18,35.2 v17.92,35.45
GYR_CS  (via drill 0.5)
  Top 0.254: U10.4 29.77,22.02 26.18,18.43 v24.65,18.43 | v15.64,27.96 16.93,27.96
  Bottom 0.254: v24.65,18.43 24.65,21.35 18.05,27.96 v15.64,27.96
GYR_DR  (via drill 0.5, 0.5 layers 1-2)
  Top 0.254: U10.28 32.27,32.65 32.78,33.16 v33.8,33.16 | U6.6 16.39,27.32 v15.51,26.43
  GND 0.254: v15.51,26.43 16.15,26.43 17.54,27.83 17.54,28.34 16.02,29.86 16.02,31.13 v17.03,32.15 | v20.97,31.26 24.65,34.81 28.34,34.81 29.23,33.93 29.23,33.16 29.86,32.53 31,32.53 31.64,33.16 v33.8,33.16
  Bottom 0.254: v17.03,32.15 17.92,31.26 v20.97,31.26
I2CCLK  (via drill 0.5)  (1 unrouted)
  Top 0.254: U4.P2 34.11,40.22 33.67,40.66 v33.67,41.16 33.67,42.56 34.31,43.2 36.85,43.2 37.03,43.02 R1.2 41.76,41.42 43.2,41.42 43.79,42.02 U7.2 | U10.32 30.27,33.06 31.51,34.31 v31.51,41.16
  Bottom 0.254: v31.51,41.16 v33.67,41.16
I2CDAT  (via drill 0.5)  (1 unrouted)
  Top 0.254: U4.P3 34.99,39.39 33.54,39.39 v32.66,40.28 | U10.31 30.77,32.8 32.02,34.05 32.02,39.64 v32.66,40.28 | v32.66,40.28 32.66,45.74 33.94,47.02 R2.2 41.7,45.48 43.2,45.48 43.73,46.02 U12.2
LED1  (via drill 0.5)
  Top 0.254: U2.9 23.88,48.39 22.11,46.63 21.23,46.63 v21.1,46.5 | v5.35,39.01 6.09,38.27 JP3.5
  Bottom 0.254: v21.1,46.5 20.59,46.24 12.84,38.5 5.86,38.5 v5.35,39.01
MAG_DR
  Top 0.254: U4.P9 37.02,37.78 36.97,37.74 37.74,37.74 37.99,37.48 37.99,36.34 37.61,35.96 36.72,35.96 35.32,34.56 33.29,34.56 31.77,33.04 U10.29
MCU_LED  (via drill 0.6)
  Top 0.254: U10.38 26.65,29.27 25.92,29.99 25.92,30.75 25.42,31.26 v24.78,31.26 | JP3.4 7.75,38.77 v7,39.51
  VCC 0.254: v24.78,31.26 24.78,33.29 24.15,33.93 16.78,33.93 11.7,39.01 7.51,39.01 v7,39.51
N$1  (via drill 0.5, 0.5 layers 1-2)
  Top 0.254: U10.33 29.77,33.96 v30.37,34.56
  GND 0.254: v40.4,33.8 40.15,34.05 30.88,34.05 v30.37,34.56
  Bottom 0.254: v40.4,33.8 41.46,33.8 U5.5
N$2  (via drill 0.5)
  Top 0.254: U8.15 U8.14 47.27,32.42 C16.2 47.9,33.05 v47.9,34.94
  Bottom 0.254: U5.2 45.89,32.94 v47.9,34.94
N$3  (via drill 0.5 layers 1-2)
  Top 0.254: U2.1 20.21,52.09 18.05,52.09 v17.16,51.2
  GND 0.254: v17.16,51.2 18.43,52.47 26.56,52.47 31.02,56.92 SL1.2
N$4
  Top 0.203: U3.11 37.6,51.21 37.74,51.07
  Top 0.254: 37.74,51.07 39.64,49.17 42.82,49.17 42.94,49.29 45.99,49.29 48.02,47.26 49.55,47.26 50.56,46.24 50.56,43.32 48.6,41.36 U7.4
N$5
  Top 0.254: U10.19 41.62,27.27 43.62,29.27 U8.2
N$6  (via drill 0.6)
  Top 0.203: U3.10 37.12,50.8 37.23,50.69
  Top 0.254: 37.23,50.69 39.39,48.53 42.94,48.53 43.2,48.78 45.1,48.78 v45.99,47.9 | U12.4 v49.04,45.36
  Bottom 0.254: v45.99,47.9 46.5,47.9 v49.04,45.36
N$8
  Top 0.254: U6.14 21.36,26.69 22.11,26.69 22.75,26.05 22.75,23.89 21.48,22.62 17.29,22.62 15.89,24.02 C15.2
N$9
  Top 0.254: U10.12 33.81,23.38 40.15,23.38 42.56,20.97 46.37,20.97 48.8,23.4 SV1.1
N$10  (via drill 0.5, 0.6)
  Top 0.406: U10.37 27.43,30.9 25.92,32.4 25.92,34.81 v27.96,36.85 | U10.48 27.43,23.75 v25.92,22.24
  VCC 0.406: JP2.2 52.38,41.71 47.77,37.1 28.21,37.1 v27.96,36.85 25.92,34.81 v25.92,22.24
  Bottom 0.406: v25.92,22.24 27.58,22.24 28.95,20.87 C11.1 C12.2
N$11
  Top 0.254: U10.13 40.03,24.27 42.82,21.48 46.12,21.48 50.57,25.94 SV1.3
N$12
  Top 0.254: U10.42 25.23,27.27 24.53,26.56 24.53,22.62 23.89,21.99 20.84,21.99 C22.2 19.19,17.69 19.19,15.38 19.96,14.62 X1.P$1
N$15
  Top 0.254: U10.43 25.5,26.77 25.04,26.31 25.04,22.19 C25.2 23.12,18.07 X1.P$3
N$16  (via drill 0.5)
  Top 0.254: v25.67,13.61 27.09,13.61 U9.10
  Bottom 0.254: U11.2 16.63,17.01 17.92,18.3 19.19,18.3 24.4,13.1 25.16,13.1 v25.67,13.61
N$17  (via drill 0.5, 0.6)
  Top 0.254: v26.56,12.59 26.78,12.59 U9.11 | v13.99,15.89 16.91,15.89 v18.18,17.16
  Bottom 0.254: v18.18,17.16 19.57,17.16 24.15,12.59 v26.56,12.59 | U11.1 15.54,17.44 v13.99,15.89
N$18  (via drill 0.5)
  Top 0.254: U10.16 41.45,25.77 v43.7,23.51 46.27,26.07 U8.5
  Bottom 0.254: 45.14,21.99 C17.2 45.17,22.05 v43.7,23.51
N$19  (via drill 0.5)
  Top 0.254: v25.29,11.7 25.8,11.7 27.08,10.41 U9.12
  Bottom 0.254: U11.8 21.34,11.7 v25.29,11.7
N$20  (via drill 0.5)
  Top 0.254: U8.4 45.72,27.05 v43.7,25.04 42.47,26.27 U10.17
  Bottom 0.254: v43.7,25.04 45.15,25.04 C18.2
N$21  (via drill 0.5)
  Top 0.254: U10.18 42.51,26.77 v43.7,27.96 | U8.16 46.27,31.11 v46.12,31.26
  Bottom 0.254: v43.7,27.96 45.11,27.96 C19.2 45.23,27.96 45.23,30.37 v46.12,31.26
N$22  (via drill 0.5, 0.5 layers 1-2)
  Top 0.203: U3.1 30.37,52.04 v30.37,52.85
  GND 0.254: v30.37,52.85 30.37,49.67 28.85,48.15 v28.72,48.15
  Bottom 0.254: v28.72,48.15 28.7,48.17 R6.2
N$23  (via drill 0.5)
  Top 0.254: U9.13 24.95,10.01 v24.27,10.68
  Bottom 0.254: U11.7 19.45,12.08 19.45,11.57 20.34,10.68 v24.27,10.68
N$25  (via drill 0.5)
  Top 0.254: U4.P6 35.02,35.63 v35.07,35.58
  Bottom 0.254: v35.07,35.58 37.45,37.96 C9.1
N$26  (via drill 0.5)
  Top 0.254: U4.P12 37.92,40.22 v38.62,39.51
  Bottom 0.254: v38.62,39.51 40.36,39.51 C10.1
N$27  (via drill 0.5)
  Top 0.254: v38.62,41.04 37.04,41.04 U4.P13
  Bottom 0.254: C10.2 38.65,41.02 v38.62,41.04
N$28  (via drill 0.5)
  Top 0.254: 21.61,52.09 21.63,52.09 U2.16 20.61,53.1 v17.03,53.1
  Bottom 0.254: R5.1 16.97,53.17 v17.03,53.1
N$29  (via drill 0.5)
  Top 0.254: U2.12 24.69,51.36 25.54,52.21 v25.54,53.61
  Bottom 0.254: R4.1 19.29,53.61 v25.54,53.61
N$30  (via drill 0.5)
  Top 0.254: U2.14 22.66,54.49 v22.65,54.5
  Bottom 0.254: v22.65,54.5 22.65,54.54 R3.1
N$31  (via drill 0.5)
  Top 0.254: U1.2 43.72,50.83 v44.85,51.96
  Bottom 0.254: v44.85,51.96 44.85,53.99 44.97,54.12 C2.2
N$32  (via drill 0.5)
  Top 0.254: v40.4,4.08 41.04,4.72 41.04,5.86 40.4,6.49 39.89,6.49 37.98,8.41 U9.34
  Bottom 0.254: U11.3 16.27,15.13 15,15.13 14.11,14.24 14.11,8.14 18.3,3.95 20.46,3.95 22.11,2.3 23,2.3 23.38,1.92 38.24,1.92 v40.4,4.08
N$33  (via drill 0.5)
  Top 0.203: v37.1,49.17 36.66,49.61 U3.7
  Bottom 0.254: 37.56,58.87 37.48,58.79 37.48,52.34 37.1,51.96 v37.1,49.17
  Bottom 0.406: SL1.3 28.46,58.03 28.46,59.07 29.73,60.34 36.08,60.34 37.56,58.87 R7.1
N$34
  Top 0.254: U10.14 40.29,24.77 43.07,21.99 45.86,21.99 52.34,28.46 52.73,28.46 SV1.5
N$37  (via drill 0.5)
  Top 0.254: v39.01,4.08 39.01,5.73 37.12,7.62 U9.32
  Bottom 0.254: U11.5 18.65,14.33 14.75,10.43 14.75,8.4 18.69,4.46 20.72,4.46 22.37,2.81 23.26,2.81 23.64,2.43 37.23,2.43 v39.01,4.08
N$38
  Top 0.254: U10.15 40.55,25.27 43.32,22.5 45.48,22.5 50.18,27.19 50.18,28.45 SV1.7
N$39  (via drill 0.6)
  Top 0.254: U3.3 30.59,50.56 | U3.4 30.66,50.56 30.37,50.56
  Top 0.305: 30.59,50.56 30.37,50.56 | U2.3 20.71,50.56 | U2.2 20.65,50.56 20.46,50.56
  Top 0.406: v19.07,50.56 20.46,50.56 20.71,50.56 | v27.7,51.32 28.97,51.32 29.73,50.56 30.24,50.56 30.37,50.56 30.5,50.56
  Bottom 0.254: 31,53.61 31.02,53.6 C5.2
  Bottom 0.406: 26.88,52.15 28.31,53.59 C5.2 33.56,55.13 SL1.1 | v27.7,51.32 26.88,52.15 | 26.88,52.15 26.81,52.21 20.72,52.21 v19.07,50.56
N$43  (via drill 0.5)
  Top 0.254: v40.02,5.48 37.47,8.03 U9.33
  Bottom 0.254: U11.CD2 27.69,15.26 28.34,14.62 28.34,6.87 29.99,5.22 31.13,5.22 32.78,3.57 36.97,3.57 38.88,5.48 v40.02,5.48
N$44  (via drill 0.5 layers 1-2)
  Top 0.254: U10.22 35.75,28.77 v36.08,29.1
  GND 0.254: SV1.8 54,29.73 44.21,29.73 43.2,28.72 38.12,28.72 37.86,28.97 36.21,28.97 v36.08,29.1
N$46  (via drill 0.5)
  Top 0.254: v31.64,3.32 31.63,3.33 U9.27
  Bottom 0.254: R8.2 23.86,3.32 v31.64,3.32
N$48  (via drill 0.5)
  Top 0.254: U9.38 38.84,10.01 v40.28,11.45
  Bottom 0.254: v40.28,11.45 40.28,10.15 C23.1
RF_LFN  (via drill 0.5)
  Top 0.254: U13.4 27.99,44.43 25.16,47.26 23.51,47.26 v19.57,43.32 | v5.86,36.97 6.15,37.27 JP3.7
  Bottom 0.254: v19.57,43.32 18.43,43.32 13.1,37.99 6.87,37.99 v5.86,36.97
RF_LFP  (via drill 0.5)
  Top 0.254: U13.3 27.34,44.19 24.91,46.63 23.64,46.63 21.35,44.34 v21.35,43.32 | v7.51,36.08 8.19,36.77 JP3.8
  Bottom 0.254: v21.35,43.32 20.21,42.18 18.05,42.18 13.35,37.48 8.91,37.48 v7.51,36.08
RF_WK
  Top 0.254: U10.34 29.27,38.64 U13.8
RFWK_CS  (via drill 0.5)
  Top 0.254: U13.11 26.69,37.87 23.38,34.56 v23.38,32.27 | v24.78,17.29 25.8,17.29 30.27,21.76 U10.5
  Bottom 0.254: v23.38,32.27 23.38,25.92 25.42,23.89 25.42,23.26 24.78,22.62 24.78,21.99 25.54,21.23 25.54,18.05 v24.78,17.29
SD_CD  (via drill 0.5, 0.5 layers 1-2)
  Top 0.254: v35.07,4.97 34.4,4.97 U9.30 | U10.26 33.27,31.36 v34.18,32.27
  GND 0.254: v35.58,16.53 34.69,17.42 34.69,19.57 33.42,20.84 33.42,31.51 v34.18,32.27
  Bottom 0.254: v35.58,16.53 36.85,15.26 36.85,8.91 35.07,7.13 v35.07,4.97
SD_CS  (via drill 0.5)
  Top 0.254: U10.6 30.77,21.24 v25.8,16.27 | U9.14 24.49,9.63 v24.02,9.16
  Bottom 0.254: v25.8,16.27 27.7,14.37 27.7,11.7 25.16,9.16 v24.02,9.16
SPI_CLK  (via drill 0.5, 0.6)
  Top 0.254: 19.47,31.59 v20.69,32.81 U13.12 | U10.11 33.27,22.65 33.54,22.37 v34.81,22.37 38.24,22.37 39.26,21.35 39.26,12.08 38.37,11.19 v35.45,11.19 | v33.29,4.59 32.41,5.47 U9.29
  Bottom 0.254: v20.69,32.81 21.17,33.29 24.02,33.29 26.81,30.5 32.78,30.5 34.81,28.46 v34.81,22.37 | v35.45,11.19 33.29,9.03 v33.29,4.59
SPI_MISO  (via drill 0.5, 0.5 layers 1-2)
  Top 0.254: 18.17,33.41 v21.61,36.85 24.45,39.69 U13.14 | U10.25 35.32,32.16 v35.32,33.04 | v36.97,15.13 v32.27,15.13 | U9.17 v27.19,8.41 v27.19,8.4
  GND 0.254: v36.97,15.13 36.97,16.53 35.32,18.18 35.32,19.96 33.93,21.35 33.93,30.88 35.32,32.27 v35.32,33.04 | v32.27,15.13 32.15,15.13 29.99,12.97 29.99,11.19 v27.19,8.4
  Bottom 0.254: v35.32,33.04 34.81,32.53 27.96,32.53 27.07,33.42 27.07,34.81 25.04,36.85 v21.61,36.85
SPI_MOSI  (via drill 0.5)
  Top 0.254: U10.24 34.6,30.54 v37.1,33.04 | U13.13 v21.46,35.34 18.82,32.69 | v36.34,6.37 34.33,6.37 U9.31
  GND 0.254: v37.1,33.04 34.56,30.5 34.56,24.15 35.96,22.75 35.96,18.94 v37.99,16.91
  Bottom 0.254: v37.1,33.04 36.85,33.04 35.83,32.02 27.58,32.02 26.43,33.16 26.43,34.56 25.65,35.34 v21.46,35.34 | v37.99,16.91 37.99,8.02 v36.34,6.37
SU_BERR  (via drill 0.5)
  Top 0.254: U10.40 25.36,28.27 v24.78,28.85 | U9.6 30.81,13.92 29.73,15 v29.73,17.03
  VCC 0.254: v24.78,28.85 24.78,21.99 v29.73,17.03
SU_BUSY  (via drill 0.5)
  Top 0.254: U9.7 30.41,13.44 28.59,15.26 v28.59,16.15 | U10.39 26.13,28.77 v24.78,30.12
  VCC 0.254: v28.59,16.15 28.59,17.29 23.77,22.11 23.77,29.1 v24.78,30.12
SU_FREF  (via drill 0.5 layers 1-2)
  Top 0.254: U10.27 32.77,32.04 32.8,32.04 v33.04,32.27 | U9.25 30.81,5.41 v30.88,5.35
  GND 0.254: v33.04,32.27 32.91,32.15 32.91,20.46 33.93,19.45 33.93,14.37 33.67,14.11 32.02,14.11 30.88,12.97 30.88,12.59 32.78,10.68 32.78,6.11 32.02,5.35 v30.88,5.35
SU_MODE
  Top 0.254: U9.8 30.03,12.81 27.45,15.38 27.45,17.05 32.27,21.87 U10.9
SWUARTRX  (via drill 0.5 layers 1-2)
  Top 0.254: U10.2 28.77,22.54 26.31,20.08 25.42,20.08 v24.78,20.72 | JP3.13 18.38,36.77 v18.43,36.72
  GND 0.254: v24.78,20.72 18.81,26.69 18.81,36.34 v18.43,36.72
SWUARTTX  (via drill 0.5 layers 1-2)
  Top 0.254: U10.1 28.27,23.19 v25.92,20.84 | v18.05,37.86 17.45,37.27 JP3.14
  GND 0.254: v25.92,20.84 19.45,27.32 19.45,37.48 19.07,37.86 v18.05,37.86
UARTRX  (via drill 0.6)
  Top 0.254: U10.21 36.65,28.27 37.1,28.72 v37.1,31 | v20.08,39.26 JP3.18
  Bottom 0.254: v20.08,39.26 20.08,34.56 20.72,33.93 24.15,33.93 27.07,31 v37.1,31
UARTTX  (via drill 0.6)
  Top 0.254: U10.20 38.18,27.77 39.01,28.59 v39.01,29.73 | v18.81,40.4 18.18,39.77 JP3.19
  Bottom 0.254: v39.01,29.73 39.01,31.26 38.24,32.02 36.59,32.02 36.08,31.51 27.32,31.51 24.4,34.43 20.97,34.43 20.59,34.81 20.59,38.12 21.1,38.62 21.1,39.89 20.59,40.4 v18.81,40.4
V2.5  (via drill 0.5, 0.5 layers 1-2, 0.6 layers 1-2)
  Top 0.203: U3.5 30.81,50 v28.77,50 | U3.2 29.98,51.21 29.1,52.09 v29.1,52.59
  Top 0.254: v30.37,48.15 30.37,48.4 v28.77,50 | 47.46,46.68 U12.5 49.37,46.68 49.93,46.12 49.93,44.72 49.17,43.96 v47.13,43.96 47.13,42.75 U7.5 47.12,42.68
  GND 0.254: v30.37,48.15 33.42,45.1 45.99,45.1 v47.13,43.96
  Bottom 0.254: v28.77,50 28.63,49.87 R6.1 | C6.2 30.01,50 v28.77,50 | v29.1,52.59 28.77,52.26 v28.77,50
VBUS  (via drill 0.5, 0.6)
  Top 0.254: v23.64,55.52 23.64,52.54 U2.13
  Top 0.406: v7.76,28.21 4.72,28.21 2.3,30.62 2.3,37.61 9.16,44.47 9.16,48.78 16.65,56.28 22.88,56.28 v23.64,55.52
  Bottom 0.254: C4.2 24.02,55.89 v23.64,55.52
  Bottom 0.406: JP1.VBUS 7.76,28.62 v7.76,28.21
VCC  (via drill 0.5, 0.5 layers 1-2, 0.5 layers 15-16, 0.6, 0.7 layers 15-16)  (1 unrouted)
  Top 0.254: U1.1 44.45,50.17 v46.24,51.96 | U13.15 23.45,40.34 v23.38,40.4 | C14.2 C13.2 14.35,30.5 v17.03,30.5 | 22.5,29.12 v22.5,30.12 20.46,30.12 20.12,29.77 U6.1 | 22.5,29.12 U6.16 | U6.15 22.24,27.32 22.5,27.58 22.5,29.12 | v16.02,14.11 C26.2 | U9.9 29.62,12.45 27.19,14.88 v25.8,14.88 | U9.5 31.22,17.45 v30.37,18.3 | v34.18,12.84 33.48,12.14 U9.40 U9.39 33.48,10.75 33.54,10.81 | U9.23 30.03,4.24 v29.99,4.21 29.99,3.06 30.75,2.3 32.53,2.3 32.91,2.68 32.91,3.57 32.01,4.47 U9.28 | U10.23 35.11,29.27 v36.08,30.24 | R1.1 42.07,42.82 v43.32,42.82 | R2.1 42.13,46.75 v43.32,46.75
  Top 0.305: v35.96,42.31 36.02,42.25 U4.P14 U4.P1 | U13.5 29.99,42.11 v29.99,42.56
  Top 0.406: JP3.1 9.81,40.52 v9.8,40.53
  GND 0.254: SV1.11 49.69,33.04 45.99,33.04 43.07,30.12 40.15,30.12 39.51,30.75 38.5,30.75 37.86,30.12 36.21,30.12 v36.08,30.24
  VCC 0.254: 46.37,34.94 v46.24,34.94 | v40.4,32.02 40.28,32.02
  VCC 0.406: v46.63,50.18 46.63,50.05 | v9.8,40.53 9.54,40.53
  Bottom 0.254: v46.24,51.96 47.81,51.96 C3.2 | U5.1 44.9,34.94 v46.24,34.94 | U5.4 40.44,31.99 v40.4,32.02 | v23.38,40.4 23.38,41.55 C24.2 | C24.2 24.02,42.18 | C24.2 | v17.03,30.5 17.42,30.12 v22.5,30.12 | U11.4 16.82,14.11 v16.02,14.11 | C20.1 26.33,7.87 v29.99,4.21 | C8.1 40.15,44 40.15,43.96 37.6,43.96 C7.+ 35.96,45.74 v35.96,42.31
  Bottom 0.305: SV1.4 59.02,29.67 C21.1 | 40.15,44.02 40.15,43.96
  Bottom 0.406: C3.2 48.02,51.57 v46.63,50.18
  pour VCC (isolate 0.305): 31.02,0.02 arc90 62.02,31.02 arc90 31.02,62.02 arc90 0.02,31.02 arc90
VCC_JTAG
  Top 0.305: SV1.2 57.55,25.66 57.55,43.45 56.15,44.85 56.15,47.64 53.78,50.01 JP2.3
XB_SLEEP  (via drill 0.5)
  Top 0.254: U10.35 28.77,32.99 v28.08,33.67 | v22.11,39.13 21.23,38.24 19.19,38.24 18.67,38.77 JP3.17
  Bottom 0.254: v22.11,39.13 23.64,39.13 28.08,34.69 v28.08,33.67

### Text on the board
tPlace: * | *
bPlace: 3.7V Bat | VCC J1 | USB | SD | JTAG